# EAGLE schematic 12v6abuckconverter (EAGLE 9.5.1)
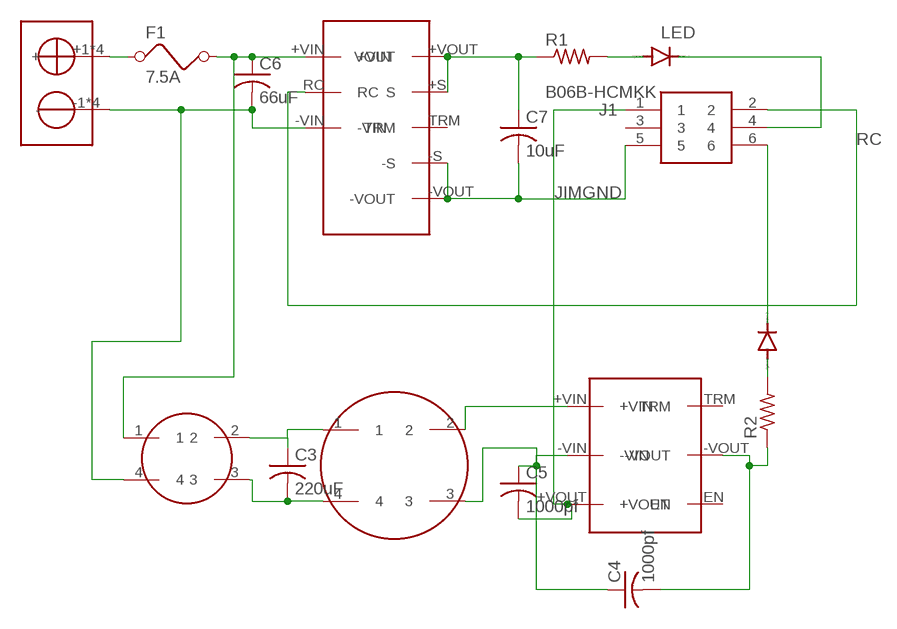
[diagram p0: schematic, sheet 1]

## Parts
BUCK150UH  CMNMODECHOKE150UH  [CMNMODECHOKE150UH]
C3  220uF  C-USC0805  [C0805]
C4  1000pf  C-USC0805  [C0805]
C5  1000pf  C-USC0805  [C0805]
C6  66uF  C-USC0805  [C0805]
C7  10uF  C-USC0805  [C0805]
D1  BYV95  [SOD57-10]
D2  BYV95  [SOD57-10]
F1  7.5A  FUSE  [FUSE]
J1  B06B-HCMKK  [B06BHCMKK]
R1  R-US_R0805  [R0805]
R2  R-US_R0805  [R0805]
U$1  12V6ABUCKCONVERTER  [12V6ABUCKCONVERTER]
U$2  SB50  [MINI-SB-50]
U$3  BUCK1.6A  [BUCK1.6A]
U$4  CMNMODECHOKE1.2MH  [CMNMODECHOKE1.2MH]

## Nets
JIMGND: C7.2 J1.5 U$1.-S U$1.-VOUT
LED: D1.C J1.4
N$1: C7.1 R1.1 U$1.+S(S) U$1.+VOUT(VOUT)
N$2: BUCK150UH.2 C3.1 U$4.1
N$3: BUCK150UH.1 C6.1 F1.2 U$1.+VIN
N$4: D1.A R1.2
N$5: BUCK150UH.3 C3.2 U$4.4
N$6: F1.1 U$2.+1(+) U$2.+2(+) U$2.+3(+) U$2.+4(+)
N$7: C4.1 C5.1 U$3.-VIN U$4.3
N$8: C4.2 R2.1 U$3.-VOUT
N$9: C5.2 J1.1 U$3.+VOUT
N$10: U$3.+VIN U$4.2
N$11: BUCK150UH.4 C6.2 U$1.-VIN U$2.-1(-) U$2.-2(-) U$2.-3(-) U$2.-4(-)
N$12: D2.C J1.6
N$13: D2.A R2.2
RC: J1.2 U$1.RC
Unconnected: J1.3 U$1.TRM U$3.EN U$3.TRM

## Library data of the parts
BUCK150UH = cmnModeChoke150uH:CMNMODECHOKE150UH
C3-C7 = rcl:C-US: CAPACITOR, American symbol; SPICEPREFIX: C
D1 D2 = diode:BYV95: DIODE fast soft-recovery controlled avalanche rectifier
F1 = special:FUSE: FUSE 5 x 20 mm
J1 = B06B-HCMKK:B06B-HCMKK: Automotive Connectors 6P AIT Header Top Position (BLK) Source: Datasheet <https://componentsearchengine.com/Datasheets/1/B06B-HCMKK.pdf>; DESCRIPTION: Automotive Connectors 6P AIT Header Top Position (BLK); HEIGHT: 13.7mm; MANUFACTURER_NAME: JST (JAPAN SOLDERLESS TERMINALS); MANUFACTURER_PART_NUMBER: B06B-HCMKK; MOUSER_PART_NUMBER: 306-B06B-HCMKK; MOUSER_PRICE-STOCK: https://www.mouser.com/Search/Refine.aspx?Keyword=306-B06B-HCMKK
R1 R2 = rcl:R-US_: RESISTOR, American symbol; SPICEPREFIX: R
U$1 = 12v6aBuckConverter:12V6ABUCKCONVERTER
U$2 = REV BLDC:SB50
U$3 = buck_1.6:BUCK1.6A
U$4 = cmnModeChoke1.2mH:CMNMODECHOKE1.2MH